# Altium schematic sheet GPIOs.SchDoc
size A3; Author: Nguyễn Hữu Thắng; DrawnBy: Nguyễn Hữu Thắng; SheetNumber: 32; SheetTotal: 35
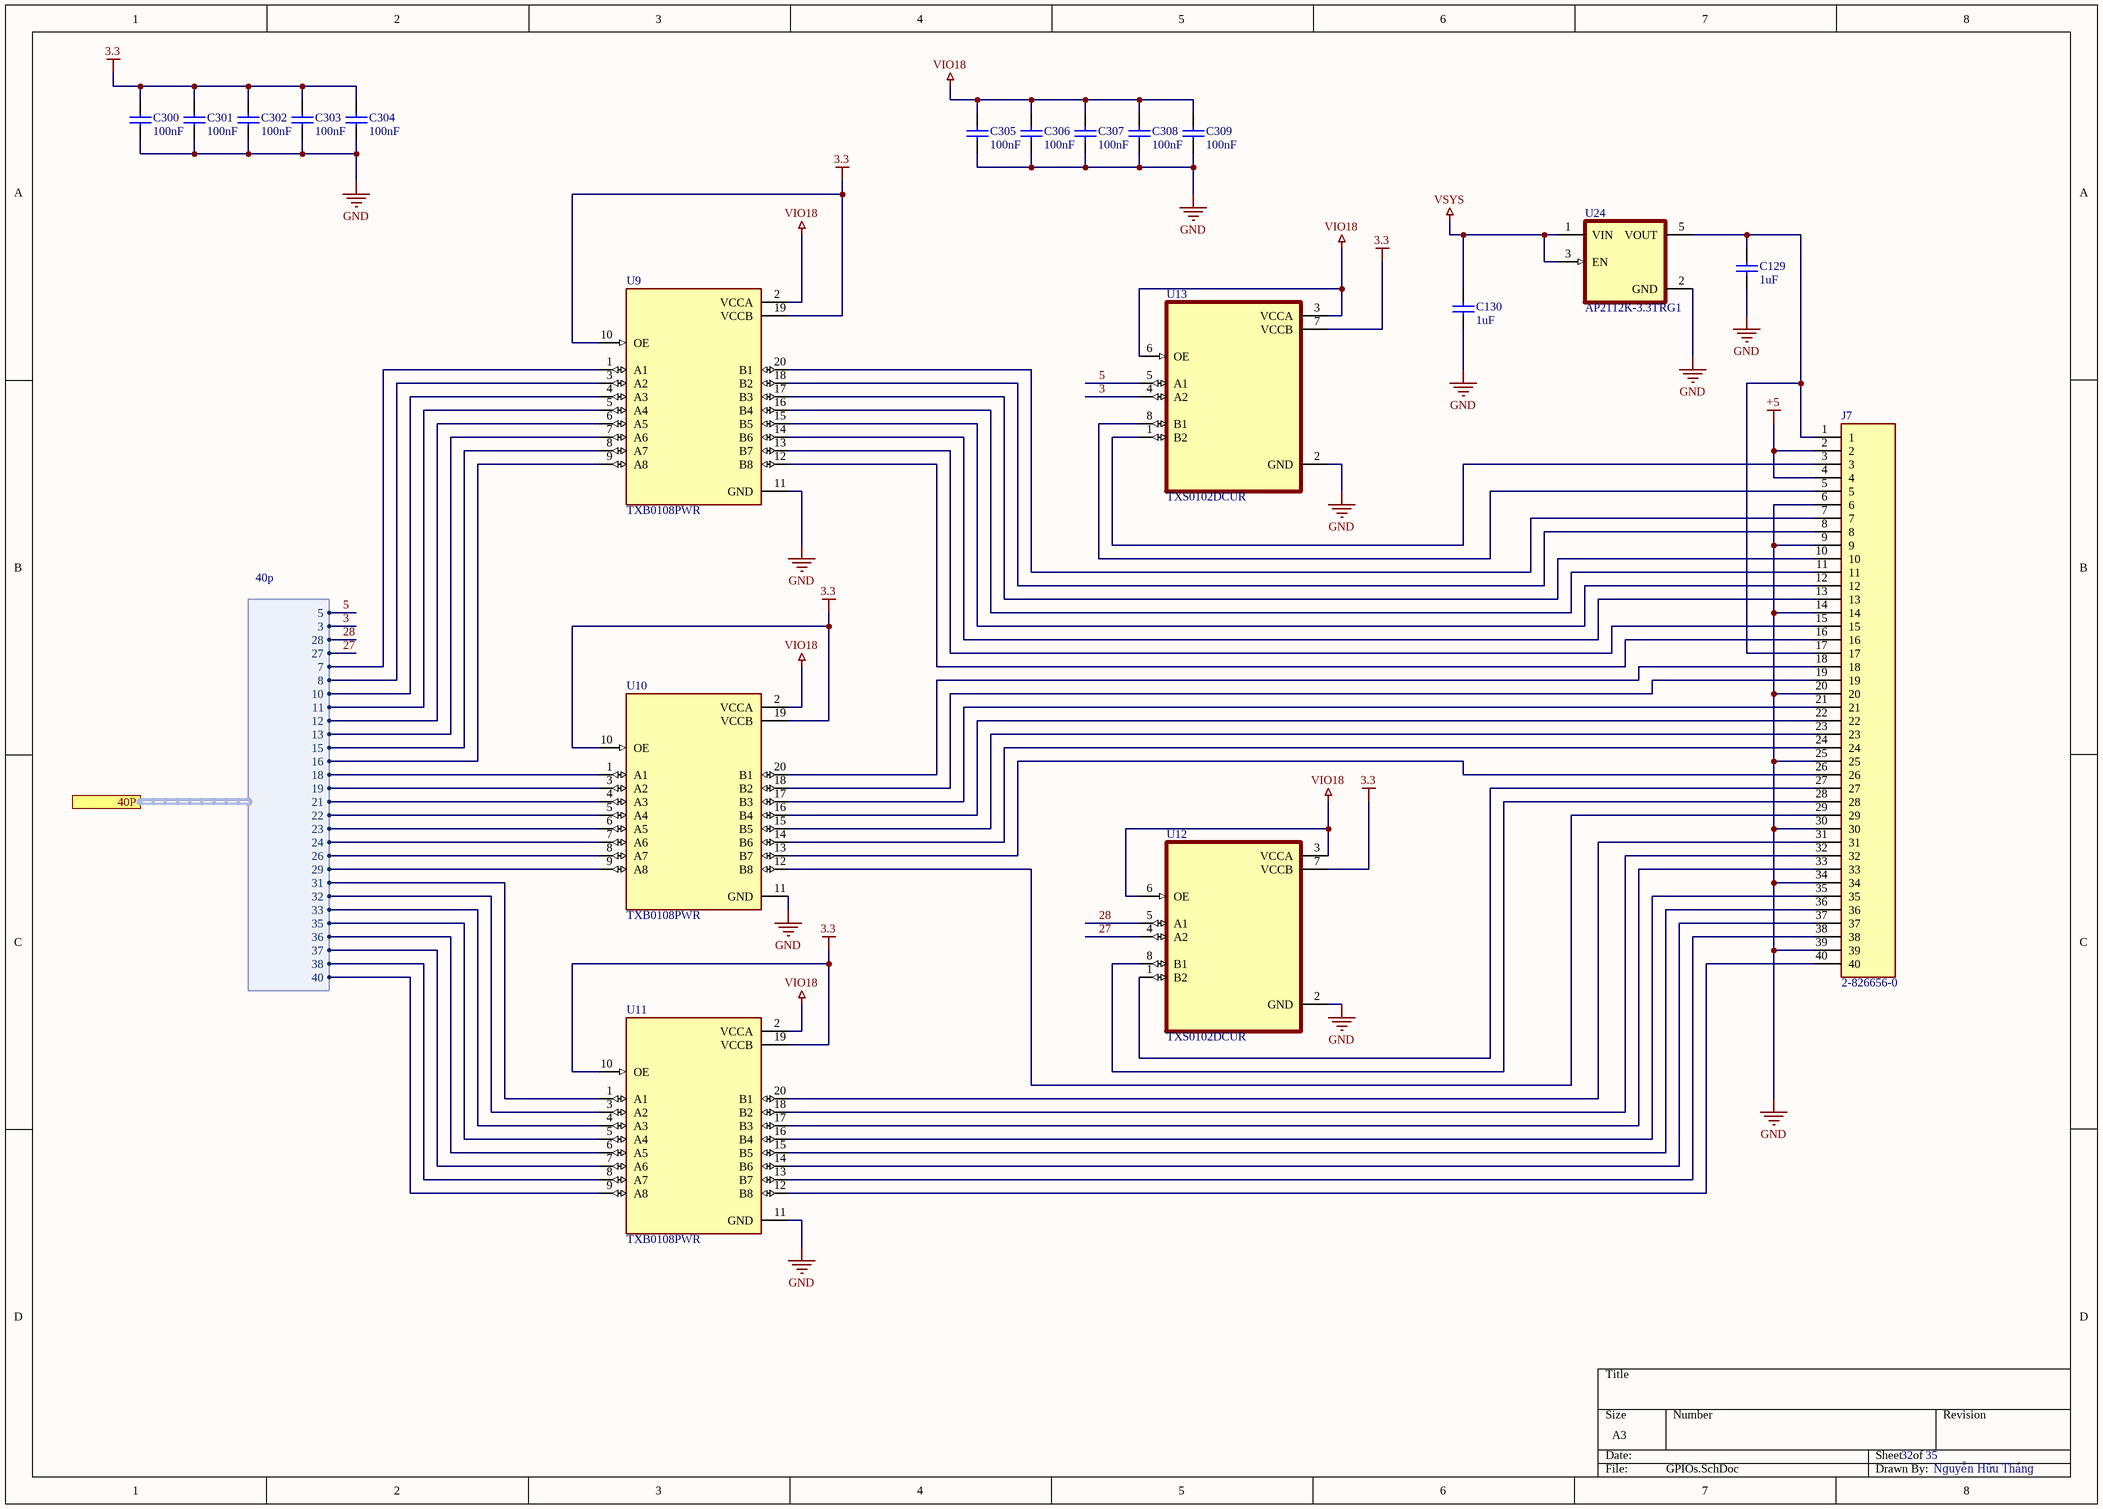
[diagram p0: GPIOs.SchDoc]

## Parts
C129  value 1uF  [C0805]  (hidden comment: C0805)
C130  value 1uF  [C0805]  (hidden comment: C0805)
C300  value 100nF  [C0603]  (hidden comment: C0603)
C301  value 100nF  [C0603]  (hidden comment: C0603)
C302  value 100nF  [C0603]  (hidden comment: C0603)
C303  value 100nF  [C0603]  (hidden comment: C0603)
C304  value 100nF  [C0603]  (hidden comment: C0603)
C305  value 100nF  [C0603]  (hidden comment: C0603)
C306  value 100nF  [C0603]  (hidden comment: C0603)
C307  value 100nF  [C0603]  (hidden comment: C0603)
C308  value 100nF  [C0603]  (hidden comment: C0603)
C309  value 100nF  [C0603]  (hidden comment: C0603)
J7  2-826656-0  [TE_2-826656-0]
U9  TXB0108PWR  [SOP65P640X120-20N]
U10  TXB0108PWR  [SOP65P640X120-20N]
U11  TXB0108PWR  [SOP65P640X120-20N]
U12  TXS0102DCUR  [SOP50P310X90-8N]
U13  TXS0102DCUR  [SOP50P310X90-8N]
U24  AP2112K-3.3TRG1  [SOT95P285X140-5N]

## Ports
40P (harness 40p, see main[6000,4000], MT8365[4600,3000], MT8365[7500,8900], MT8365[10000,5500], MT8365_AUD[3500,5200], MT8365_CONN[10500,3000], MT8365_eMMC[8900,5600])

## Harnesses
40p: 7, 8, 10, 11, 12, 13, 15, 16, 18, 19, 21, 22, 23, 24, 26, 29, 32, 35, 36, 37, 38, 40, 33, 31, 5, 3, 28, 27

## Nets
3.3: C300.2 C301.2 C302.2 C303.2 C304.2 U9.10(OE) U9.19(VCCB) U10.10(OE) U10.19(VCCB) U11.10(OE) U11.19(VCCB) U12.7(VCCB) U13.7(VCCB)
+5: J7.2 J7.4
GND: C129.1 C130.1 C300.1 C301.1 C302.1 C303.1 C304.1 C305.1 C306.1 C307.1 C308.1 C309.1 J7.6 J7.9 J7.14 J7.20 J7.25 J7.30 J7.34 J7.39 U9.11(GND) U10.11(GND) U11.11(GND) U12.2(GND) U13.2(GND) U24.2(GND)
VIO18: C305.2 C306.2 C307.2 C308.2 C309.2 U9.2(VCCA) U10.2(VCCA) U11.2(VCCA) U12.3(VCCA) U12.6(OE) U13.3(VCCA) U13.6(OE)
VSYS: C130.2 U24.1(VIN) U24.3(EN)
3: U13.4(A2) ; port 40P.3
5: U13.5(A1) ; port 40P.5
27: U12.4(A2) ; port 40P.27
28: U12.5(A1) ; port 40P.28
NetC129_2: C129.2 J7.1 J7.17 U24.5(VOUT)
NetJ7_3: J7.3 U13.1(B2)
NetJ7_5: J7.5 U13.8(B1)
NetJ7_7: J7.7 U9.20(B1)
NetJ7_8: J7.8 U9.18(B2)
NetJ7_10: J7.10 U9.17(B3)
NetJ7_11: J7.11 U9.16(B4)
NetJ7_12: J7.12 U9.15(B5)
NetJ7_13: J7.13 U9.14(B6)
NetJ7_15: J7.15 U9.13(B7)
NetJ7_16: J7.16 U9.12(B8)
NetJ7_18: J7.18 U10.20(B1)
NetJ7_19: J7.19 U10.18(B2)
NetJ7_21: J7.21 U10.17(B3)
NetJ7_22: J7.22 U10.16(B4)
NetJ7_23: J7.23 U10.15(B5)
NetJ7_24: J7.24 U10.14(B6)
NetJ7_26: J7.26 U10.13(B7)
NetJ7_27: J7.27 U12.1(B2)
NetJ7_28: J7.28 U12.8(B1)
NetJ7_29: J7.29 U10.12(B8)
NetJ7_31: J7.31 U11.20(B1)
NetJ7_32: J7.32 U11.18(B2)
NetJ7_33: J7.33 U11.17(B3)
NetJ7_35: J7.35 U11.16(B4)
NetJ7_36: J7.36 U11.15(B5)
NetJ7_37: J7.37 U11.14(B6)
NetJ7_38: J7.38 U11.13(B7)
NetJ7_40: J7.40 U11.12(B8)
NetU9_1: U9.1(A1) ; port 40P.7
NetU9_3: U9.3(A2) ; port 40P.8
NetU9_4: U9.4(A3) ; port 40P.10
NetU9_5: U9.5(A4) ; port 40P.11
NetU9_6: U9.6(A5) ; port 40P.12
NetU9_7: U9.7(A6) ; port 40P.13
NetU9_8: U9.8(A7) ; port 40P.15
NetU9_9: U9.9(A8) ; port 40P.16
NetU10_1: U10.1(A1) ; port 40P.18
NetU10_3: U10.3(A2) ; port 40P.19
NetU10_4: U10.4(A3) ; port 40P.21
NetU10_5: U10.5(A4) ; port 40P.22
NetU10_6: U10.6(A5) ; port 40P.23
NetU10_7: U10.7(A6) ; port 40P.24
NetU10_8: U10.8(A7) ; port 40P.26
NetU10_9: U10.9(A8) ; port 40P.29
NetU11_1: U11.1(A1) ; port 40P.31
NetU11_3: U11.3(A2) ; port 40P.32
NetU11_4: U11.4(A3) ; port 40P.33
NetU11_5: U11.5(A4) ; port 40P.35
NetU11_6: U11.6(A5) ; port 40P.36
NetU11_7: U11.7(A6) ; port 40P.37
NetU11_8: U11.8(A7) ; port 40P.38
NetU11_9: U11.9(A8) ; port 40P.40

## Library data of the parts
U24 = AP2112K-3.3TRG1: Linear Voltage Regulator IC Positive Fixed 1 Output 600mA SOT-25